# Altium schematic sheet Sheet1.SchDoc
size A
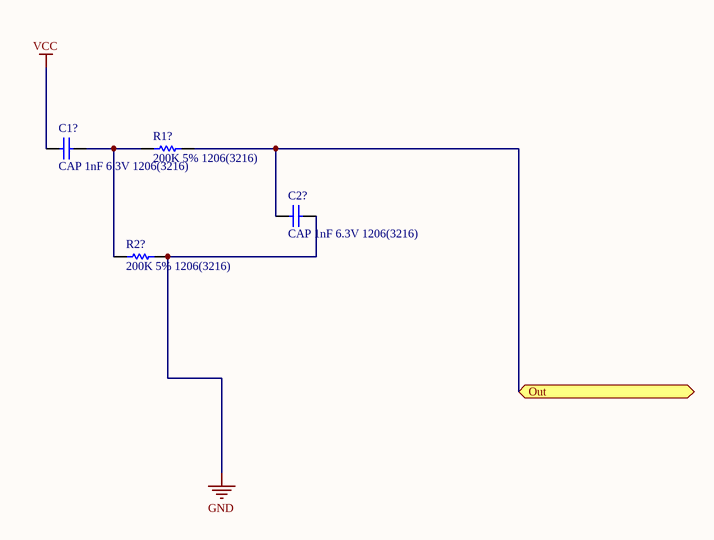
[diagram p0: Sheet1.SchDoc]

## Parts
C1?  CAP 1nF 6.3V 1206(3216)  [CAPC1206(3216)100_M]
C2?  CAP 1nF 6.3V 1206(3216)  [CAPC1206(3216)100_M]
R1?  200K 5% 1206(3216)  [RESC1206(3216)_N]
R2?  200K 5% 1206(3216)  [RESC1206(3216)_N]

## Ports
Out

## Nets
GND: C2?.2 R2?.2
VCC: C1?.1
Out: C2?.1 R1?.2 ; port Out
NetC1?_2: C1?.2 R1?.1 R2?.1

## Library data of the parts
C1? C2? = CMP-1037-02425-1: CAP 1nF 6.3V ±5% 1206 (3216 Metric) Thickness 1mm SMD; Case-EIA: 1206; Tolerance: Â±5%; Case-Metric: 3216; Value: 1nF; Rated Voltage: 6.3 V; Max Thickness: 1 mm; Technology: SMT
R1? R2? = CMP-1014-00129-1: 200K 0.25W 5% 1206 (3216 Metric)  SMD; Case-EIA: 1206; Value: 200000.00 Ohm; Case-Metric: 3216; Tolerance: 5 %; Power: 0.25 W; Technology: SMT